# Altium schematic sheet BlueBox-Amp [Speaker Protection].SchDoc
size A
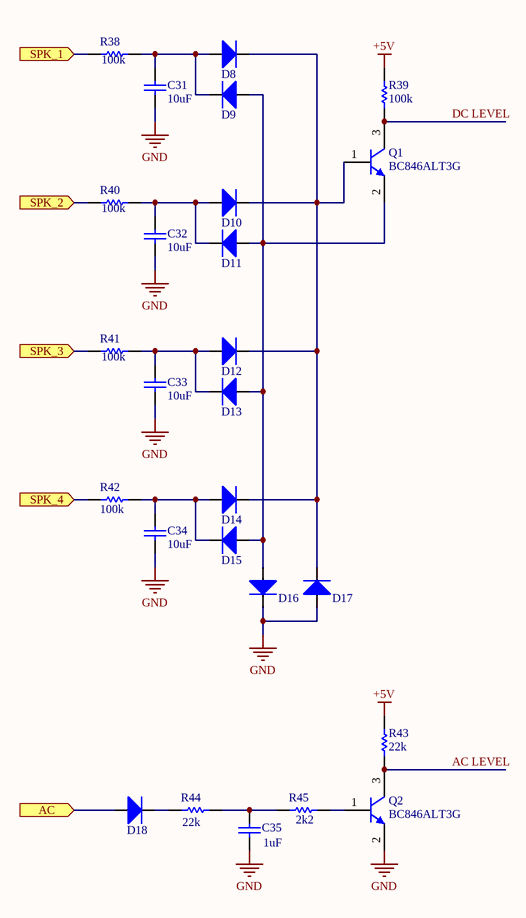
[diagram p0: BlueBox-Amp [Speaker Protection].SchDoc]

## Parts
C31  value 10uF  [CAPC1206(3216)190_M]  (hidden comment: CAP 10uF 50V 1206(3216))
C32  value 10uF  [CAPC1206(3216)190_M]  (hidden comment: CAP 10uF 50V 1206(3216))
C33  value 10uF  [CAPC1206(3216)190_M]  (hidden comment: CAP 10uF 50V 1206(3216))
C34  value 10uF  [CAPC1206(3216)190_M]  (hidden comment: CAP 10uF 50V 1206(3216))
C35  value 1uF  [CAPC0603(1608)100_L]  (hidden comment: CAP 1uF 50V 0603(1608))
D8  1N4148WS  [SOD323]  (value not drawn)
D9  1N4148WS  [SOD323]  (value not drawn)
D10  1N4148WS  [SOD323]  (value not drawn)
D11  1N4148WS  [SOD323]  (value not drawn)
D12  1N4148WS  [SOD323]  (value not drawn)
D13  1N4148WS  [SOD323]  (value not drawn)
D14  1N4148WS  [SOD323]  (value not drawn)
D15  1N4148WS  [SOD323]  (value not drawn)
D16  1N4148WS  [SOD323]  (value not drawn)
D17  1N4148WS  [SOD323]  (value not drawn)
D18  1N4148WS  [SOD323]  (value not drawn)
Q1  BC846ALT3G  [ONSC-SOT-23-3-318-08_V]
Q2  BC846ALT3G  [ONSC-SOT-23-3-318-08_V]
R38  value 100k  [RESC0603(1608)_N]  (hidden comment: 100K 1% 0603(1608))
R39  value 100k  [RESC0603(1608)_N]  (hidden comment: 100K 1% 0603(1608))
R40  value 100k  [RESC0603(1608)_N]  (hidden comment: 100K 1% 0603(1608))
R41  value 100k  [RESC0603(1608)_N]  (hidden comment: 100K 1% 0603(1608))
R42  value 100k  [RESC0603(1608)_N]  (hidden comment: 100K 1% 0603(1608))
R43  value 22k  [RESC0603(1608)_L]  (hidden comment: 22K 1% 0603(1608))
R44  value 22k  [RESC0603(1608)_L]  (hidden comment: 22K 1% 0603(1608))
R45  value 2k2  [RESC0603(1608)_L]  (hidden comment: 2K2 1% 0603(1608))

## Ports
AC, SPK_1, SPK_2, SPK_3, SPK_4

## Nets
+5V: R39.2 R43.2
GND: C31.1 C32.1 C33.1 C34.1 C35.1 D16.2(K) D17.1(A) Q2.2(E)
AC: D18.1(A) ; port AC
AC LEVEL: Q2.3(C) R43.1
DC LEVEL: Q1.3(C) R39.1
SPK_1: R38.1 ; port SPK_1
SPK_2: R40.1 ; port SPK_2
SPK_3: R41.1 ; port SPK_3
SPK_4: R42.1 ; port SPK_4
NetC31_2: C31.2 D8.1(A) D9.2(K) R38.2
NetC32_2: C32.2 D10.1(A) D11.2(K) R40.2
NetC33_2: C33.2 D12.1(A) D13.2(K) R41.2
NetC34_2: C34.2 D14.1(A) D15.2(K) R42.2
NetC35_2: C35.2 R44.2 R45.1
NetD8_2: D8.2(K) D10.2(K) D12.2(K) D14.2(K) D17.2(K) Q1.1(B)
NetD9_1: D9.1(A) D11.1(A) D13.1(A) D15.1(A) D16.1(A) Q1.2(E)
NetD18_2: D18.2(K) R44.1
NetQ2_1: Q2.1(B) R45.2

## Library data of the parts
C31-C34 = CMP-1037-04982-1: CAP 10uF 50V ±10% 1206 (3216 Metric) Thickness 1.9mm SMD; Case-EIA: 1206; Case-Metric: 3216; Technology: SMT; Tolerance: ±10%; Max Thickness: 1.9 mm; Rated Voltage: 50 V
C35 = CMP-1035-02745-1: CAP 1uF 50V ±10% 0603 (1608 Metric) Thickness 1mm SMD; Case-EIA: 0603; Case-Metric: 1608; Technology: SMT; Rated Voltage: 50 V; Max Thickness: 1 mm; Tolerance: ±10%
D8-D18 = 1N4148WS: Diode; Mouser: http://www.mouser.com/Semiconductors/Discrete-Semiconductors/Diodes-Rectifiers/Diodes-General-Purpose-Power-Switching/_/N-ax1mp?P=1z0z5meZ1z0xoywZ1z0sou6&Ns=Pricing%7c0
Q1 Q2 = CMP-1048-00778-1: General Purpose Transistor, NPN Silicon, 3-Pin SOT-23, Pb-Free, Tape and Reel; Manufacturer: On Semiconductor; IC Continuous (A): 0.1; fT Min (MHz): 100; Mounting Technology: Surface Mount; ComponentLink3URL: http://www.onsemi.cn/pub_link/Collateral/318-08.PDF; ComponentLink1URL: http://www.onsemi.com/; ComponentLink2Description: Datasheet; PartNumber: BC846ALT3G; PackageDescription: 3-Pin Small Outline Transistor, Body 2.92 x 1.3 mm, Pitch 0.95 mm; PackageVersion: Rev. AP, 11/2009; RoHS: TRUE; PackageReference: SOT-23-3-318-08; Packing: Tape and Reel; DatasheetVersion: Rev. 11; ComponentLink2URL: http://www.onsemi.cn/pub_link/Collateral/BC846ALT1-D.PDF; ComponentLink1Description: Manufacturer URL; Polarity: NPN; ComponentLink3Description: Package Specification
R38-R42 = CMP-1012-00736-1: 100K 0.1W 1% 0603 (1608 Metric)  SMD; Case-Metric: 1608; Case-EIA: 0603; Power: 0.1 W; Tolerance: 1 %; Technology: SMT
R43 R44 = CMP-1012-00659-1: 22K 0.1W 1% 0603 (1608 Metric)  SMD; Case-EIA: 0603; Case-Metric: 1608; Technology: SMT; Power: 0.1 W; Tolerance: 1 %
R45 = CMP-1012-00546-1: 2K2 0.1W 1% 0603 (1608 Metric)  SMD; Case-EIA: 0603; Case-Metric: 1608; Tolerance: 1 %; Power: 0.1 W; Technology: SMT